# Altium schematic sheet TitlePage_and_Contents.SchDoc
size A
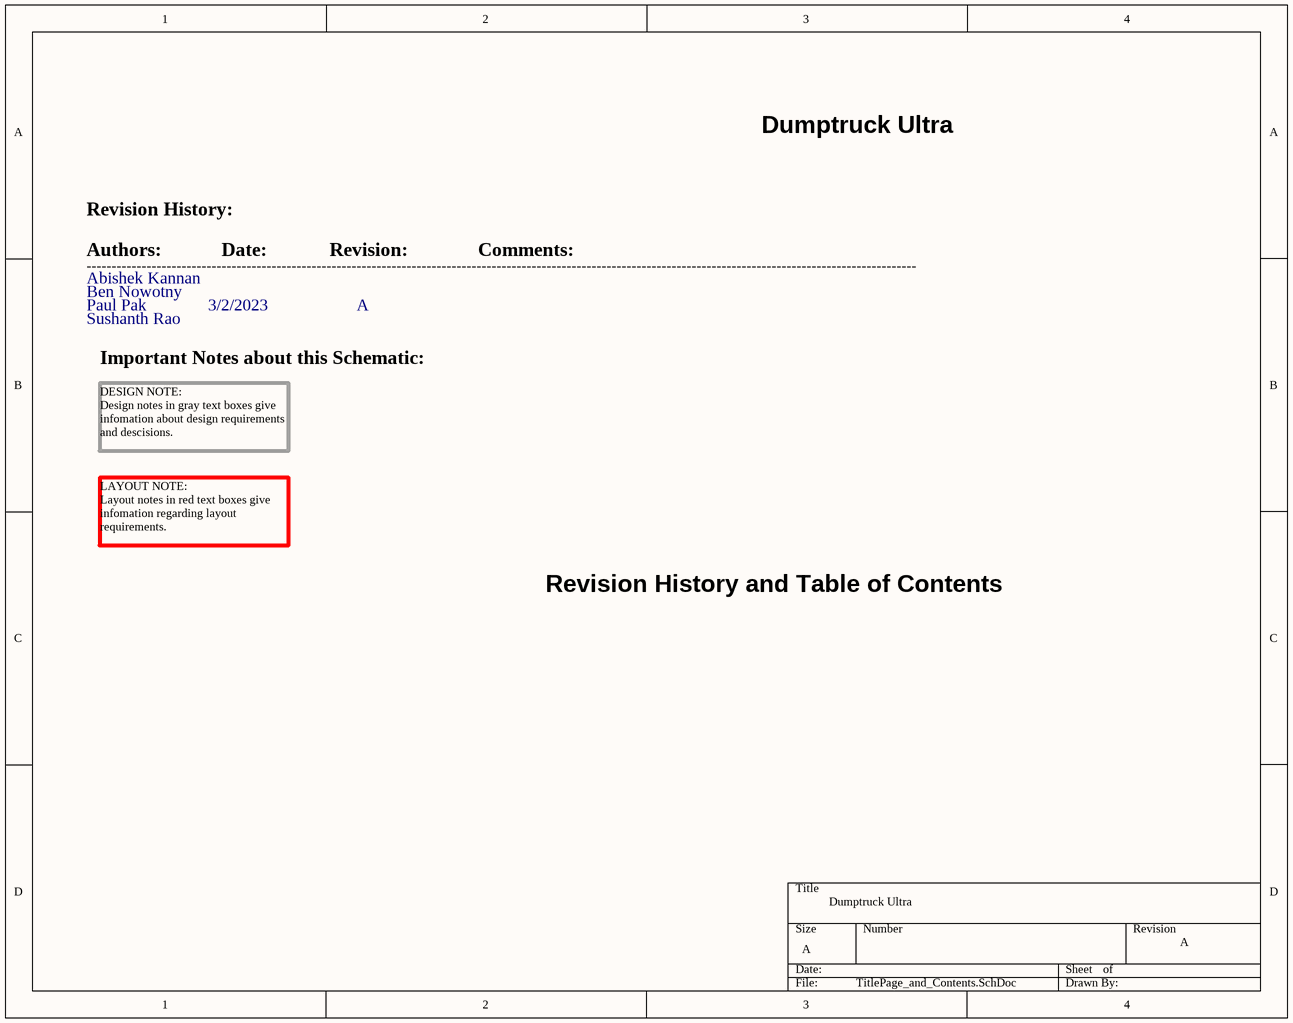
[diagram p0: TitlePage_and_Contents.SchDoc]

## Notes on the sheet
- Dumptruck Ultra
- Revision History:
- ----------------------------------------------------------------------------------------------------------------------------------------------------------------------
- Abishek Kannan
- Ben Nowotny
- Authors:
- Date:
- Revision:
- Comments:
- Paul Pak
- Sushanth Rao
- Important Notes about this Schematic:
- 3/2/2023
- A
- DESIGN NOTE:
  Design notes in gray text boxes give infomation about design requirements and descisions.
- LAYOUT NOTE:
  Layout notes in red text boxes give infomation regarding layout requirements.
- Revision History and Table of Contents